# EasyEDA schematic SCH.json
TITLE: Sheet_1; REV: 1.0; Date: 2026-08-09; Sheet: 1/1; Drawn By: ryanjetplane1; Company: Your Company
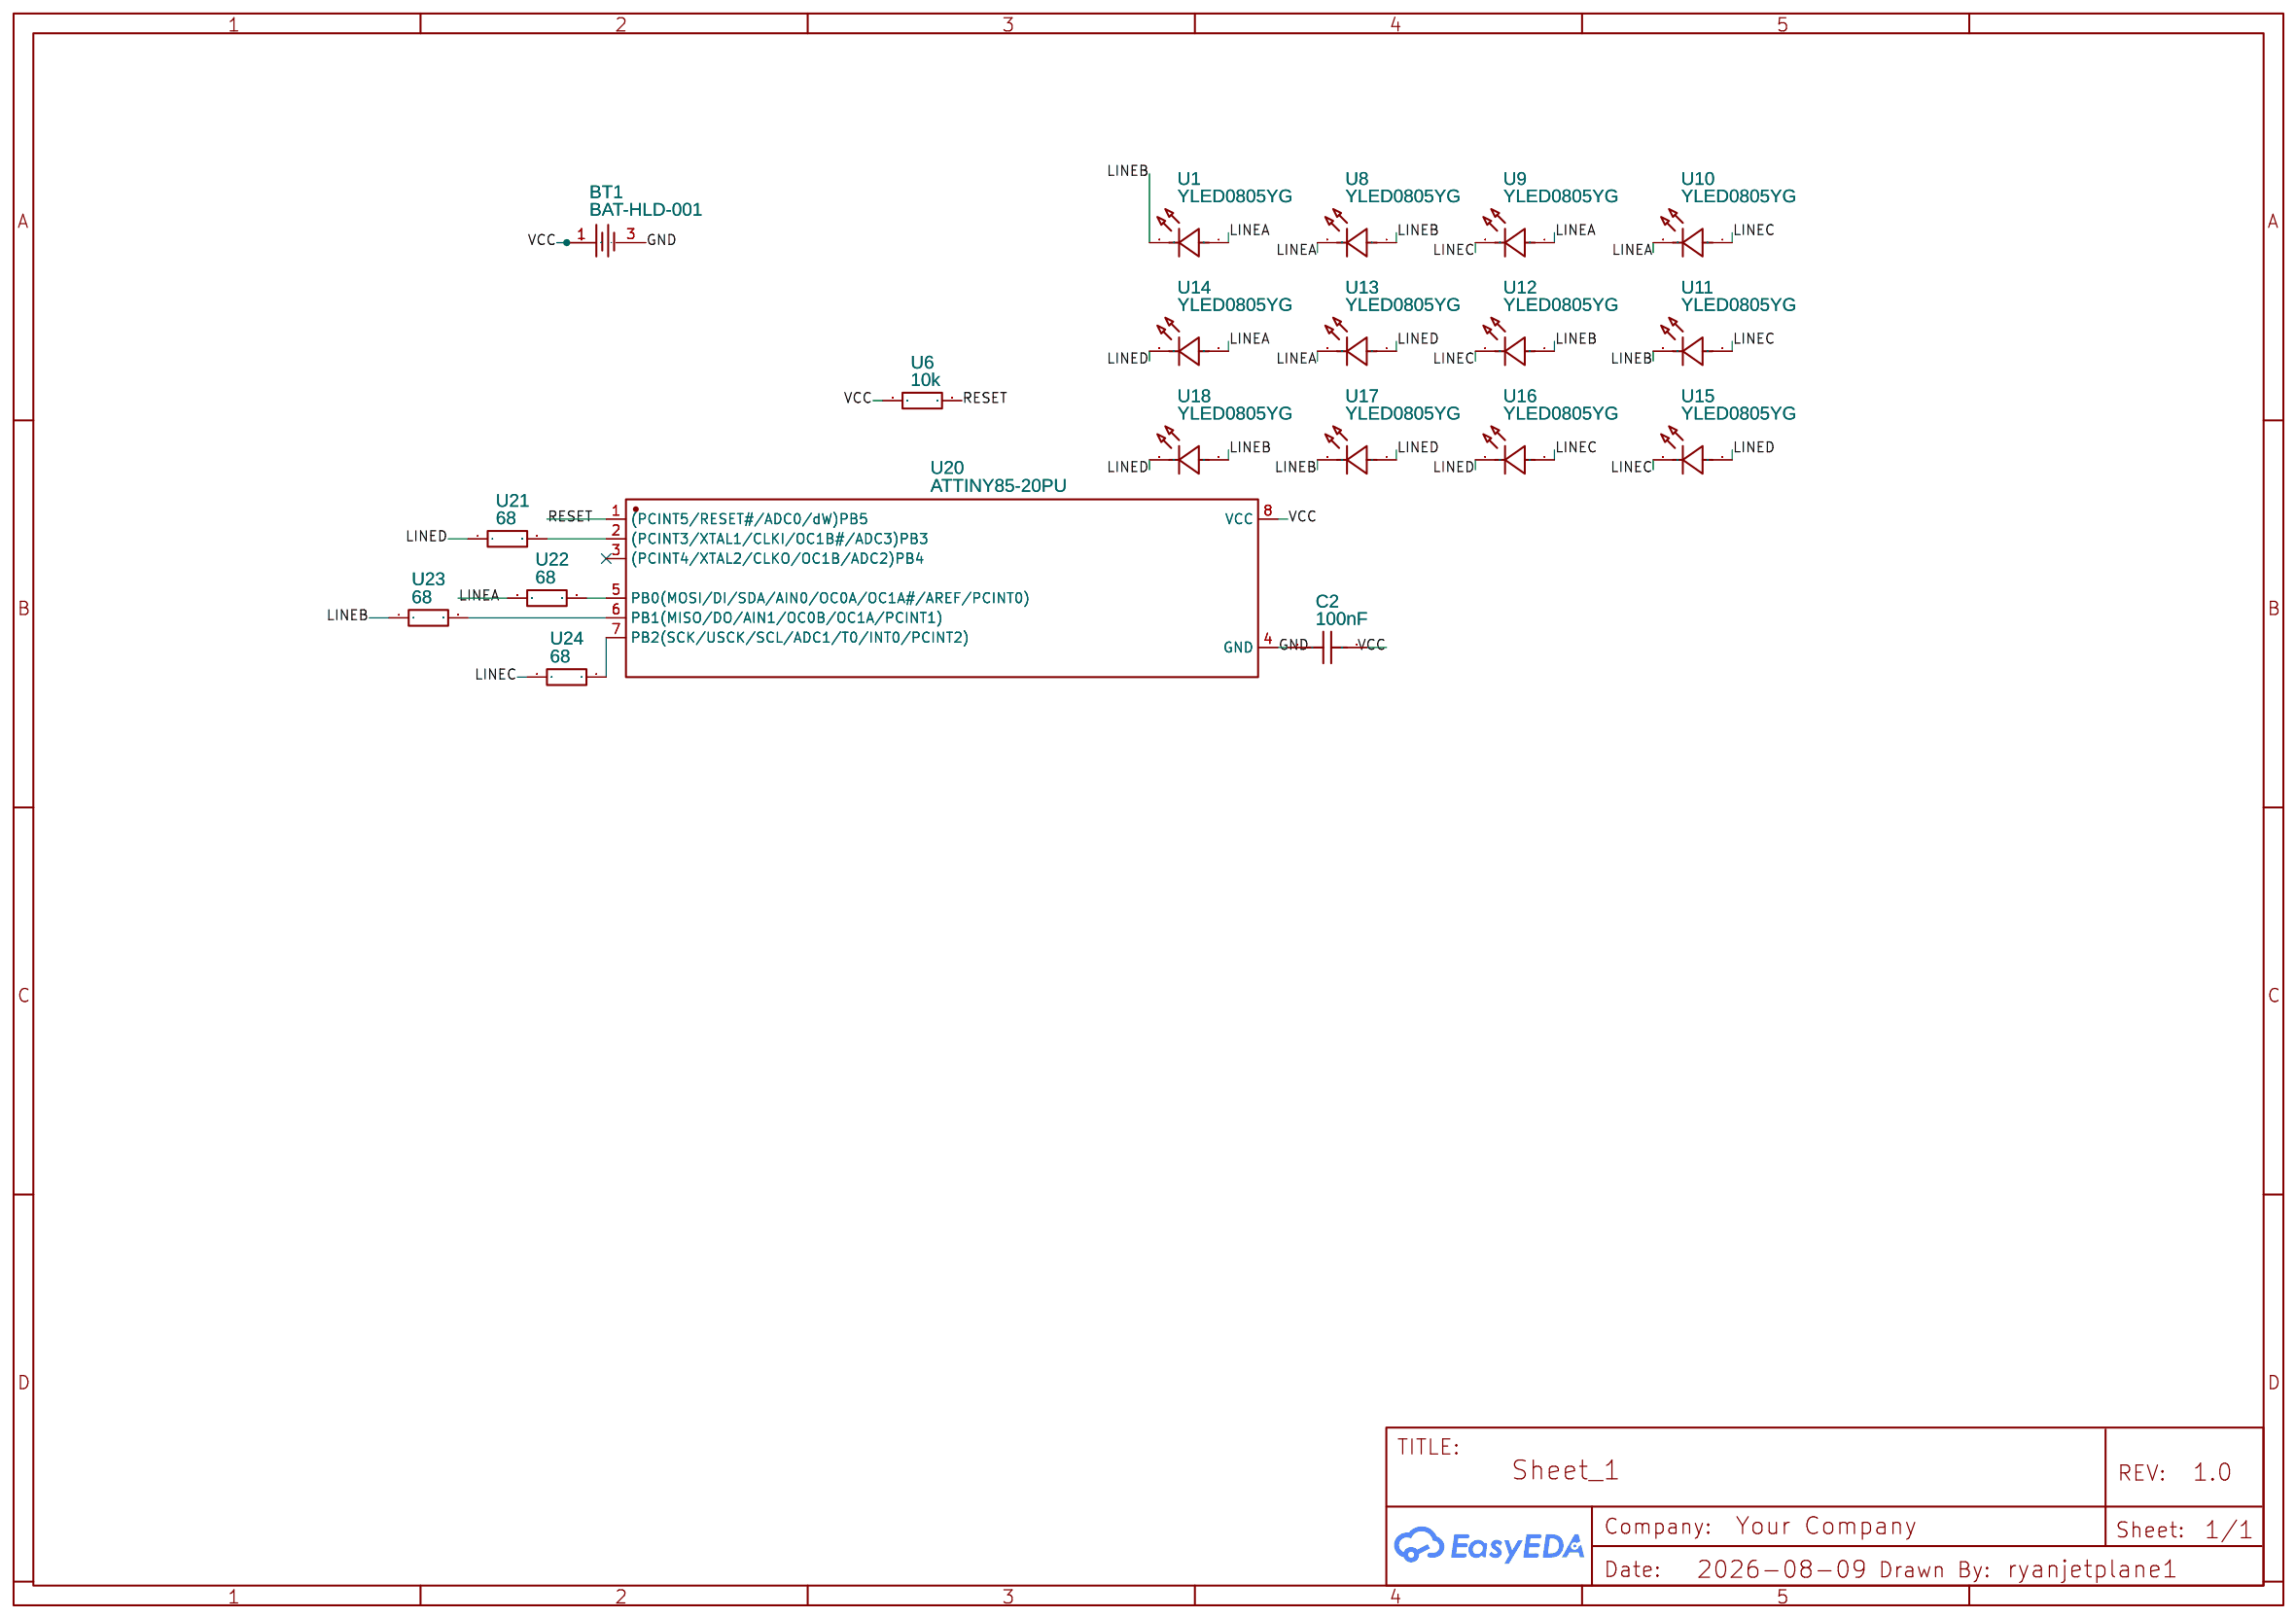
[diagram p0: schematic sheet]

## Parts
BT1  BAT-HLD-001  [BAT-SMD_BAT-HLD-001]
C2  100nF  [C0805]
U1  YLED0805YG  [LED0805-R-RD]
U6  10k  [R0805]
U8  YLED0805YG  [LED0805-R-RD]
U9  YLED0805YG  [LED0805-R-RD]
U10  YLED0805YG  [LED0805-R-RD]
U11  YLED0805YG  [LED0805-R-RD]
U12  YLED0805YG  [LED0805-R-RD]
U13  YLED0805YG  [LED0805-R-RD]
U14  YLED0805YG  [LED0805-R-RD]
U15  YLED0805YG  [LED0805-R-RD]
U16  YLED0805YG  [LED0805-R-RD]
U17  YLED0805YG  [LED0805-R-RD]
U18  YLED0805YG  [LED0805-R-RD]
U20  ATTINY85-20PU  [PDIP-8_L9.3-W6.4-P2.54-LS7.9-BL-1]
U21  68  [R0805]
U22  68  [R0805]
U23  68  [R0805]
U24  68  [R0805]

## Library data of the parts
BT1 = BAT-HLD-001: Supplier: LCSC; Supplier Part: C7501066; Manufacturer: TE Connectivity(泰科电子); JLCPCB Part Class: Extended Part; Contributor: lcsc
C2 = TCC0805X7R104M500DTS: Contributor: LCSC; Supplier: LCSC; Supplier Part: C2682489; Manufacturer: CCTC(三环); JLCPCB Part Class: Extended Part
U1 U8-U18 = YLED0805YG: Supplier: LCSC; Supplier Part: C19171393; Manufacturer: YONGYUTAI(永裕泰); Contributor: lcsc; JLCPCB Part Class: Extended Part
U6 U21-U24 = WSL0805R0260FEA: Contributor: lcsc; Supplier: LCSC; Supplier Part: C4265855; Manufacturer: VISHAY(威世); JLCPCB Part Class: Extended Part
U20 = ATTINY85-20PU: Contributor: LCSC; Supplier: LCSC; Supplier Part: C965497; Manufacturer: MICROCHIP(美国微芯); JLCPCB Part Class: Extended Part

## Nets
GND: BT1.3(-) C2.1 U20.4(GND)
VCC: BT1.1(+) BT1.2(+) C2.2 U6.1 U20.8(VCC)
LINEA: U1.1 U8.2 U9.1 U10.2 U13.2 U14.1 U22.1
LINEB: U1.2 U8.1 U11.2 U12.1 U17.2 U18.1 U23.1
LINEC: U9.2 U10.1 U11.1 U12.2 U15.2 U16.1 U24.2
LINED: U13.1 U14.2 U15.1 U16.2 U17.1 U18.2 U21.1
RESET: U6.2 U20.1((PCINT5/RESET#/ADC0/dW)PB5)
Net-(U20-2): U20.2((PCINT3/XTAL1/CLKI/OC1B#/ADC3)PB3) U21.2
Net-(U20-5): U20.5(PB0(MOSI/DI/SDA/AIN0/OC0A/OC1A#/AREF/PCINT0)) U22.2
Net-(U20-6): U20.6(PB1(MISO/DO/AIN1/OC0B/OC1A/PCINT1)) U23.2
Net-(U20-7): U20.7(PB2(SCK/USCK/SCL/ADC1/T0/INT0/PCINT2)) U24.1

Not connected (* = marked no-connect by the designer): U20 3((PCINT4/XTAL2/CLKO/OC1B/ADC2)PB4)*
